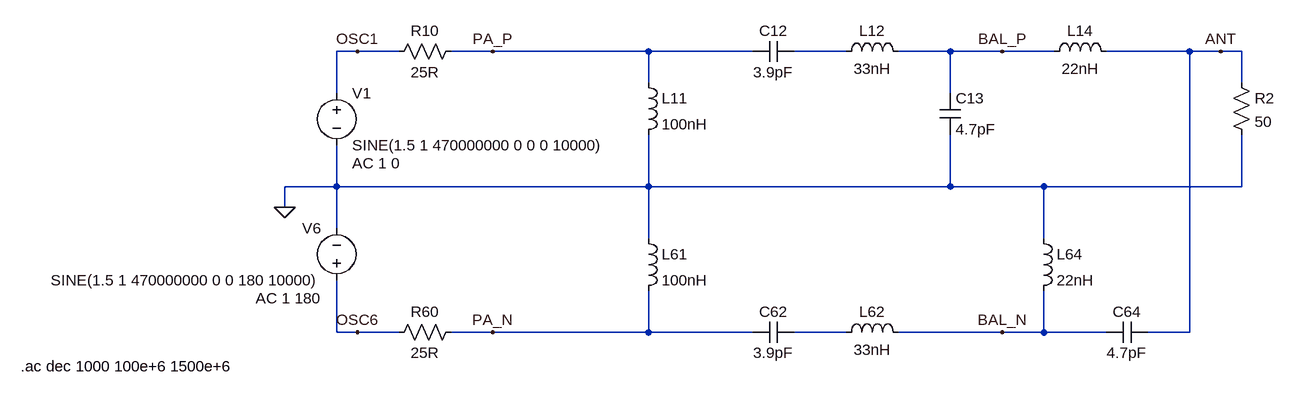
[diagram p0: schematic AX5243_PA_analytics_v1.asc]
AX5243_PA_analytics_v1.asc, the LTspice schematic file:
Version 4
SHEET 1 2248 680
WIRE 160 32 128 32
WIRE 224 32 160 32
WIRE 368 32 304 32
WIRE 608 32 368 32
WIRE 768 32 608 32
WIRE 912 32 832 32
WIRE 1072 32 992 32
WIRE 1152 32 1072 32
WIRE 1232 32 1152 32
WIRE 1440 32 1312 32
WIRE 1488 32 1440 32
WIRE 1520 32 1488 32
WIRE 608 80 608 32
WIRE 1520 80 1520 32
WIRE 128 96 128 32
WIRE 1072 96 1072 32
WIRE 128 240 128 176
WIRE 128 240 48 240
WIRE 608 240 608 160
WIRE 608 240 128 240
WIRE 1072 240 1072 160
WIRE 1072 240 608 240
WIRE 1216 240 1072 240
WIRE 1520 240 1520 160
WIRE 1520 240 1216 240
WIRE 48 272 48 240
WIRE 128 304 128 240
WIRE 608 320 608 240
WIRE 1216 320 1216 240
WIRE 128 464 128 384
WIRE 160 464 128 464
WIRE 224 464 160 464
WIRE 368 464 304 464
WIRE 608 464 608 400
WIRE 608 464 368 464
WIRE 768 464 608 464
WIRE 912 464 832 464
WIRE 1152 464 992 464
WIRE 1216 464 1216 400
WIRE 1216 464 1152 464
WIRE 1312 464 1216 464
WIRE 1440 464 1440 32
WIRE 1440 464 1376 464
FLAG 48 272 0
FLAG 160 32 OSC1
FLAG 160 464 OSC6
FLAG 368 32 PA_P
FLAG 368 464 PA_N
FLAG 1488 32 ANT
FLAG 1152 32 BAL_P
FLAG 1152 464 BAL_N
SYMBOL voltage 128 80 R0
WINDOW 123 24 124 Left 2
SYMATTR InstName V1
SYMATTR Value SINE(1.5 1 470000000 0 0 0 10000)
SYMATTR Value2 AC 1 0
SYMATTR SpiceLine Rser=0 Cpar=0
SYMBOL voltage 128 400 R180
WINDOW 0 24 96 Left 2
WINDOW 3 24 16 Left 2
WINDOW 123 24 -12 Left 2
SYMATTR InstName V6
SYMATTR Value SINE(1.5 1 470000000 0 0 180 10000)
SYMATTR Value2 AC 1 180
SYMATTR SpiceLine Rser=0 Cpar=0
SYMBOL res 208 48 R270
WINDOW 0 32 56 VTop 2
WINDOW 3 0 56 VBottom 2
SYMATTR InstName R10
SYMATTR Value 25R
SYMBOL res 208 480 R270
WINDOW 0 32 56 VTop 2
WINDOW 3 0 56 VBottom 2
SYMATTR InstName R60
SYMATTR Value 25R
SYMBOL ind 592 64 R0
SYMATTR InstName L11
SYMATTR Value 100nH
SYMATTR SpiceLine Rpar=1e+9
SYMBOL ind 592 304 R0
SYMATTR InstName L61
SYMATTR Value 100nH
SYMATTR SpiceLine Rpar=1e+9
SYMBOL cap 768 48 R270
WINDOW 0 32 32 VTop 2
WINDOW 3 0 32 VBottom 2
SYMATTR InstName C12
SYMATTR Value 3.9pF
SYMBOL cap 768 480 R270
WINDOW 0 32 32 VTop 2
WINDOW 3 0 32 VBottom 2
SYMATTR InstName C62
SYMATTR Value 3.9pF
SYMBOL res 1504 64 R0
SYMATTR InstName R2
SYMATTR Value 50
SYMBOL ind 896 48 R270
WINDOW 0 32 56 VTop 2
WINDOW 3 5 56 VBottom 2
SYMATTR InstName L12
SYMATTR Value 33nH
SYMBOL ind 896 480 R270
WINDOW 0 32 56 VTop 2
WINDOW 3 5 56 VBottom 2
SYMATTR InstName L62
SYMATTR Value 33nH
SYMBOL cap 1056 96 R0
SYMATTR InstName C13
SYMATTR Value 4.7pF
SYMBOL ind 1200 304 R0
SYMATTR InstName L64
SYMATTR Value 22nH
SYMBOL ind 1216 48 R270
WINDOW 0 32 56 VTop 2
WINDOW 3 5 56 VBottom 2
SYMATTR InstName L14
SYMATTR Value 22nH
SYMBOL cap 1312 480 R270
WINDOW 0 32 32 VTop 2
WINDOW 3 0 32 VBottom 2
SYMATTR InstName C64
SYMATTR Value 4.7pF
TEXT -358 516 Left 2 !.ac dec 1000 100e+6 1500e+6

The netlist it stands for:
* AX5243_PA_analytics_v1.asc
V1 OSC1 0 SINE(1.5 1 470000000 0 0 0 10000) AC 1 0 Rser=0 Cpar=0
V6 OSC6 0 SINE(1.5 1 470000000 0 0 180 10000) AC 1 180 Rser=0 Cpar=0
R10 OSC1 PA_P 25R
R60 OSC6 PA_N 25R
L11 PA_P 0 100nH Rpar=1e+9
L61 0 PA_N 100nH Rpar=1e+9
C12 PA_P N001 3.9pF
C62 PA_N N002 3.9pF
R2 ANT 0 50
L12 N001 BAL_P 33nH
L62 N002 BAL_N 33nH
C13 BAL_P 0 4.7pF
L64 0 BAL_N 22nH
L14 BAL_P ANT 22nH
C64 BAL_N ANT 4.7pF
.ac dec 1000 100e+6 1500e+6
.backanno
.end